# EAGLE design node_rgb (EAGLE 6.6.0)
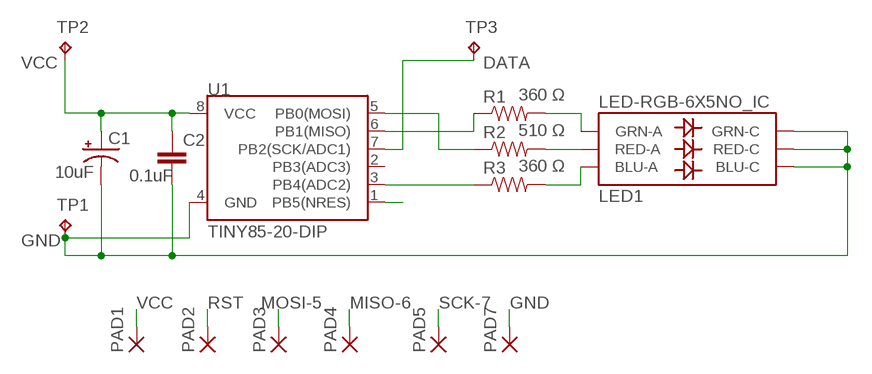
[diagram p0: schematic, sheet 1]

## Parts
C1  10uF  10UF-16V-10%(TANT)  [EIA3216]
C2  0.1uF  CAP1206  [1206]
LED1  LED-RGB-6X5NO_IC  [LED-RGB-6X5]
PAD1  SMD5  [SMD2,54-5,08]
PAD2  SMD5  [SMD2,54-5,08]
PAD3  SMD5  [SMD2,54-5,08]
PAD4  SMD5  [SMD2,54-5,08]
PAD5  SMD5  [SMD2,54-5,08]
PAD7  SMD5  [SMD2,54-5,08]
R1  360 Ω  RESISTOR1206  [1206]
R2  510 Ω  RESISTOR1206  [1206]
R3  360 Ω  RESISTOR1206  [1206]
TP1  PADSTP13R  [CIRCLE-PAD-1/4]
TP2  PADSTP13R  [CIRCLE-PAD-1/4]
TP3  PADSTP13R  [CIRCLE-PAD-1/4]
U1  TINY85-20-DIP  ATTINY45TINY45-20-DIP  [DIP08]

## Nets
ADC2: R3.1 U1.3(PB4(ADC2))
GND: C1.C(-) C2.2 LED1.1(BLU-C) LED1.2(RED-C) LED1.3(GRN-C) PAD7.1(P) TP1.TP U1.4(GND)
MISO-6: PAD4.1(P) R1.1 U1.6(PB1(MISO))
MOSI-5: PAD3.1(P) R2.1 U1.5(PB0(MOSI))
N$1: LED1.4(GRN-A) R1.2
N$2: LED1.5(RED-A) R2.2
N$3: LED1.6(BLU-A) R3.2
RST: PAD2.1(P) U1.1(PB5(NRES))
SCK-7: PAD5.1(P) TP3.TP U1.7(PB2(SCK/ADC1))
VCC: C1.A(+) C2.1 PAD1.1(P) TP2.TP U1.8(VCC)
Unconnected: U1.2(PB3(ADC3))

## Library data of the parts
C1 = SparkFun-Capacitors:10UF-16V-10%(TANT): CAP-00811 1206/EIA-3216 Tantalum capacitor; PROD_ID: CAP-00811
C2 = SparkFun-Capacitors:CAP: Capacitor Standard 0603 ceramic capacitor, and 0.1" leaded capacitor.
LED1 = swamy-library:LED-RGB-6X5: SMD LED-RGB-6x5
PAD1-PAD5 PAD7 = wirepad:SMD5: SMD PAD
R1-R3 = SparkFun-Resistors:RESISTOR: Resistor Basic schematic elements and footprints for 0603, 1206, and PTH resistors.
TP1 = swamy-library:PADS: Pads; TP_SIGNAL_NAME: GND
TP2 = swamy-library:PADS: Pads; TP_SIGNAL_NAME: VCC
TP3 = swamy-library:PADS: Pads; TP_SIGNAL_NAME: DATA
U1 = SparkFun-DigitalIC:ATTINY45: Atmel 8-pin 2/4/8kB flash uC; PROD_ID: IC-09439; VALUE: TINY45-20-DIP

## Board
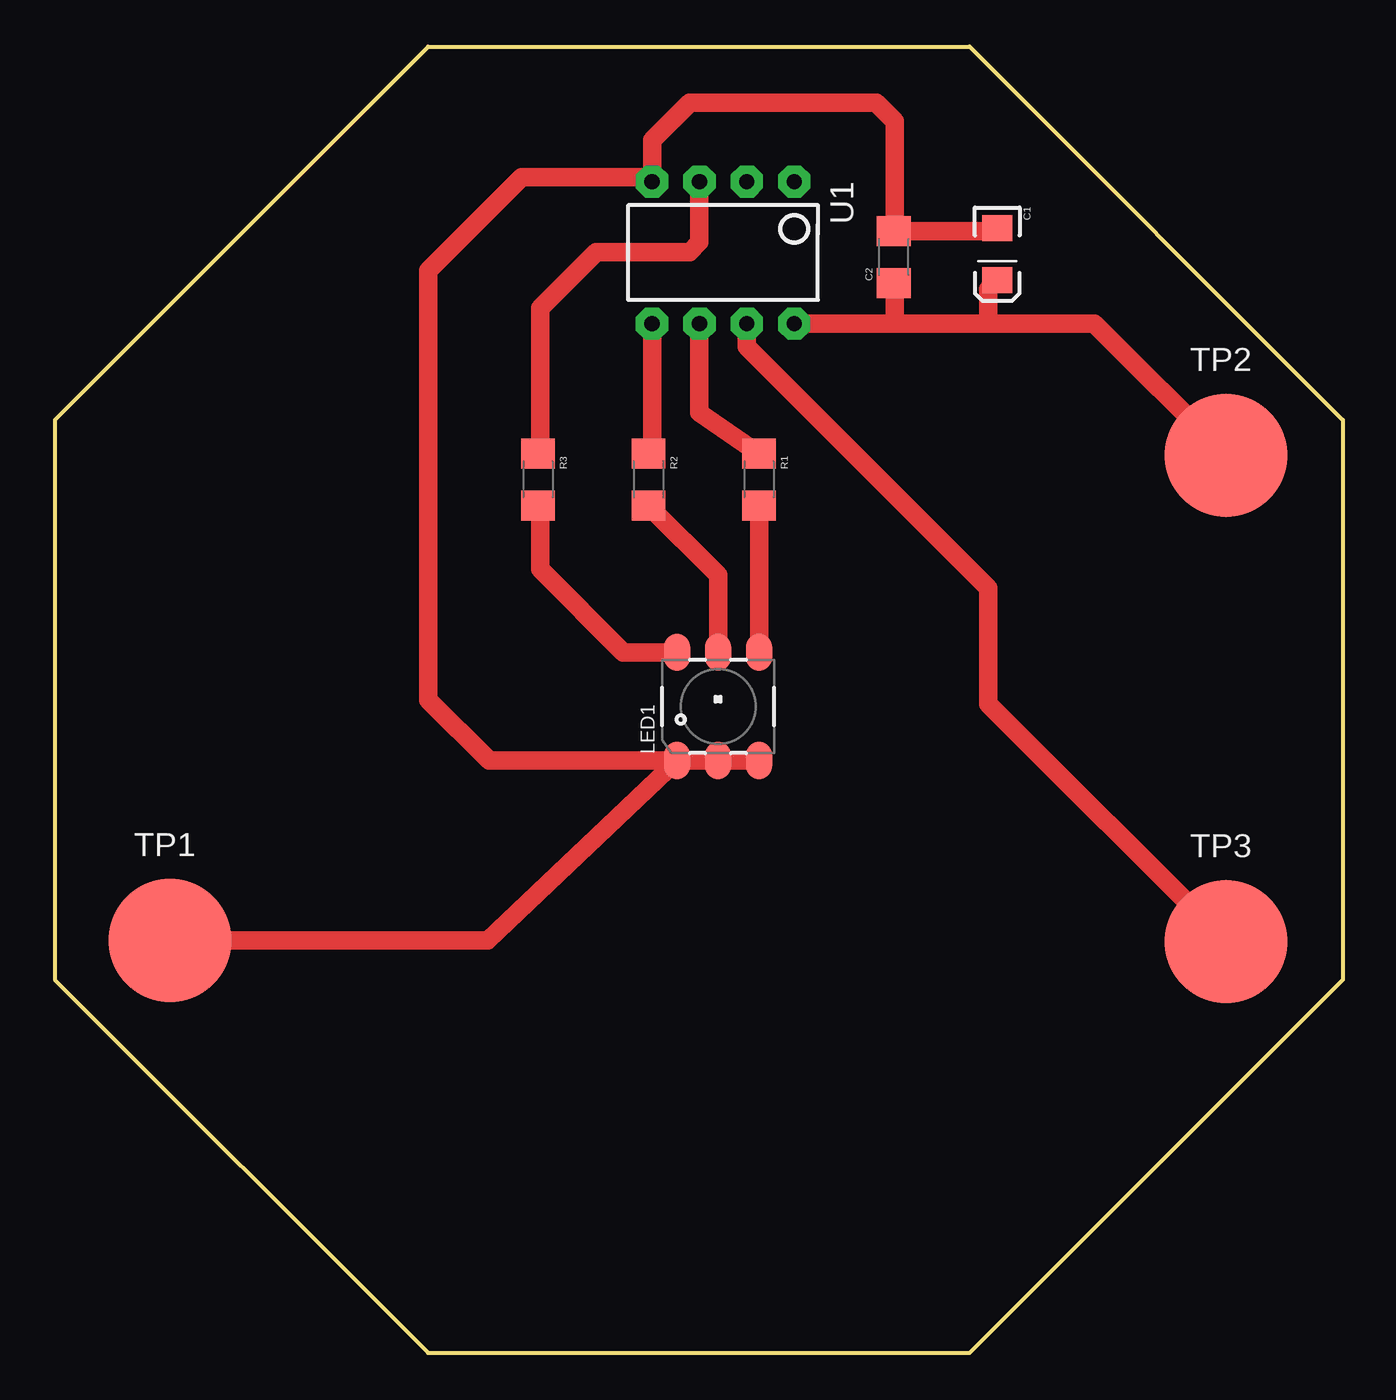
[diagram p1: board, top side]
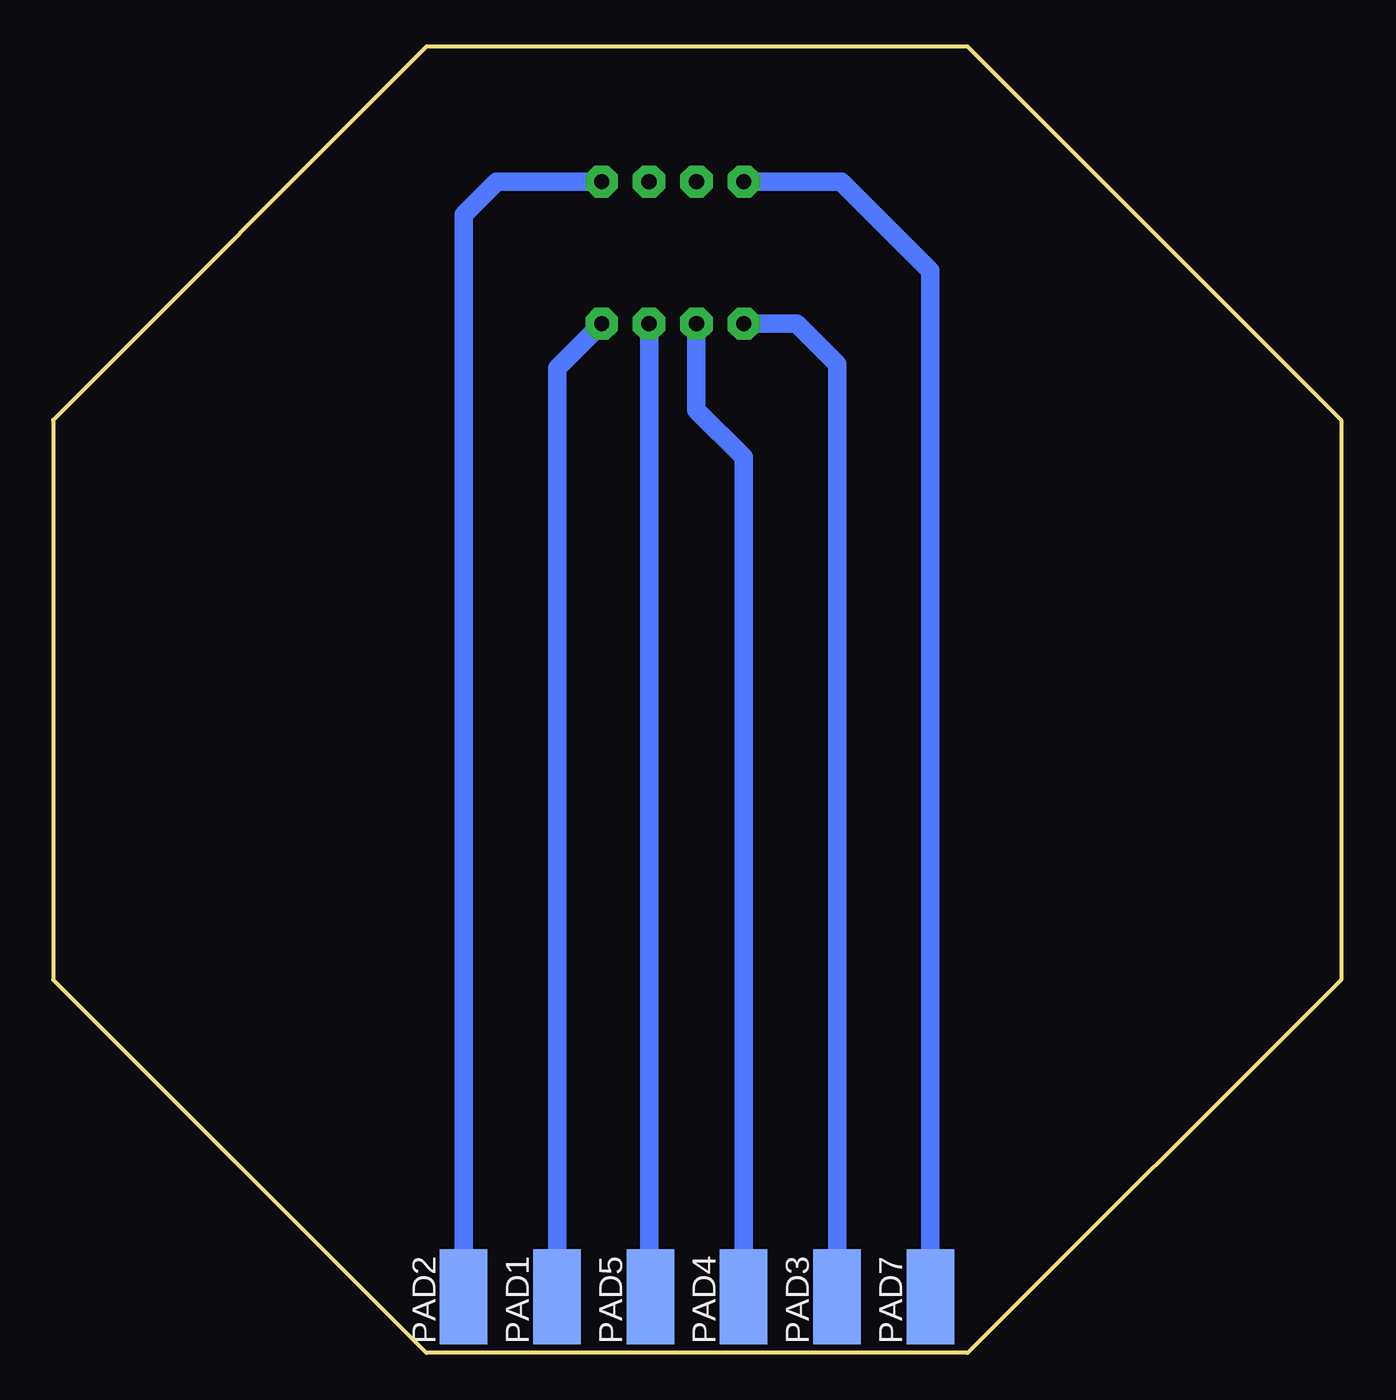
[diagram p2: board, bottom side, seen from below]

Size 69 x 70 mm. Coordinates in mm from the lower left corner, seen from the top.
Outline: 20,70 49,70 69,50 69,20 49,0 20,0 0,20 0,50 20,70
Copper layers (1*16): Top 0.035mm / dielectric 1.5mm / Bottom 0.035mm
Design rules "default": minimum track width 10mil, minimum drill 24mil, track to track 8mil, track to pad 8mil, pad to pad 8mil, via to via 8mil, smd to smd 8mil, copper to edge 40mil, drill to drill 8mil, minimum pad ring 10mil, minimum via ring 8mil, stop-mask expansion 4mil, vias tented up to drill 0mil, thermal gap 10mil

### Footprints (pad centres in the part's own frame; a part is rotated, then mirrored left to right if it is on the bottom)
EIA3216 = smd 1.4 x 1.6: A 1.4,0; C -1.4,0
1206 = smd 1.6 x 1.8: 1 -1.4,0; 2 1.4,0
LED-RGB-6X5 = smd 2 x 1.4: 1 -2.9,2.2; 2 -2.9,0; 3 -2.9,-2.2; 4 2.9,-2.2; 5 2.9,0; 6 2.9,2.2
SMD2,54-5,08 = smd 2.54 x 5.08: 1 0,0
CIRCLE-PAD-1/4 = smd 6.604 x 6.604: TP 0,0
DIP08 = drill 0.813 pad 1.727 octagon: 1 -3.81,-3.81; 2 -1.27,-3.81; 3 1.27,-3.81; 4 3.81,-3.81; 5 3.81,3.81; 6 1.27,3.81; 7 -1.27,3.81; 8 -3.81,3.81

### Placement (x,y rotation side)
C1  50.48,58.88 270 top
C2  44.94,58.72 90 top
LED1  35.53,34.64 90 top
PAD1  42,3 0 bottom
PAD2  47,3 0 bottom
PAD3  27,3 0 bottom
PAD4  32,3 0 bottom
PAD5  37,3 0 bottom
PAD7  22,3 0 bottom
R1  37.72,46.8 270 top
R2  31.8,46.8 270 top
R3  25.88,46.8 270 top
TP1  6.16,22.1 0 top
TP2  62.74,48.1 0 top
TP3  62.74,22.04 0 top
U1  35.8,58.96 180 top

### Tracks (layer width: path | path; a pad name or v marks a point on that pad's centre or on a via)
ADC2
  Top 1: R3.1 26,48.32 26,56 29,59 34,59 34.53,59.53 U1.3
GND
  Top 1: TP1.TP 23.19,22.1 LED1.1 | LED1.1 LED1.2 LED1.3 | C1.C 50.32,60.12 C2.2 45,60.18 45,66 44,67 34,67 31.99,64.99 U1.4 31.76,63 25,63 20,58 20,35 23.26,31.74 LED1.1
  Bottom 1: PAD7.1 22,58 26.77,62.77 U1.4
MISO-6
  Top 1: R1.1 34.53,50.39 U1.6
  Bottom 1: PAD4.1 32,48 34.53,50.53 U1.6
MOSI-5
  Top 1: R2.1 31.99,48.39 U1.5
  Bottom 1: PAD3.1 27,53 29.15,55.15 U1.5
N$1
  Top 1: R1.2 37.73,44.39 LED1.4
N$2
  Top 1: R2.2 35.53,41.67 LED1.5
N$3
  Top 1: LED1.6 30.46,37.54 26,42 26,45.28 R3.2
RST
  Bottom 1: PAD2.1 47,61 45.23,62.77 U1.1
SCK-7
  Top 1: U1.7 37.07,53.93 50,41 50,34.78 TP3.TP
  Bottom 0.762: PAD5.1 37.07,3.07
  Bottom 1: 37.07,3.07 U1.7
VCC
  Top 1: TP2.TP 55.69,55.15 50,55.15 | 50,55.15 45,55.15 | 45,55.15 U1.8 | C2.1 45,57.26 45,55.15 | C1.A 50,57 50,55.15
  Bottom 1: PAD1.1 42,52.76 U1.8

### Text on the board
tLabels: VCC | GND | DATA | RGB Module